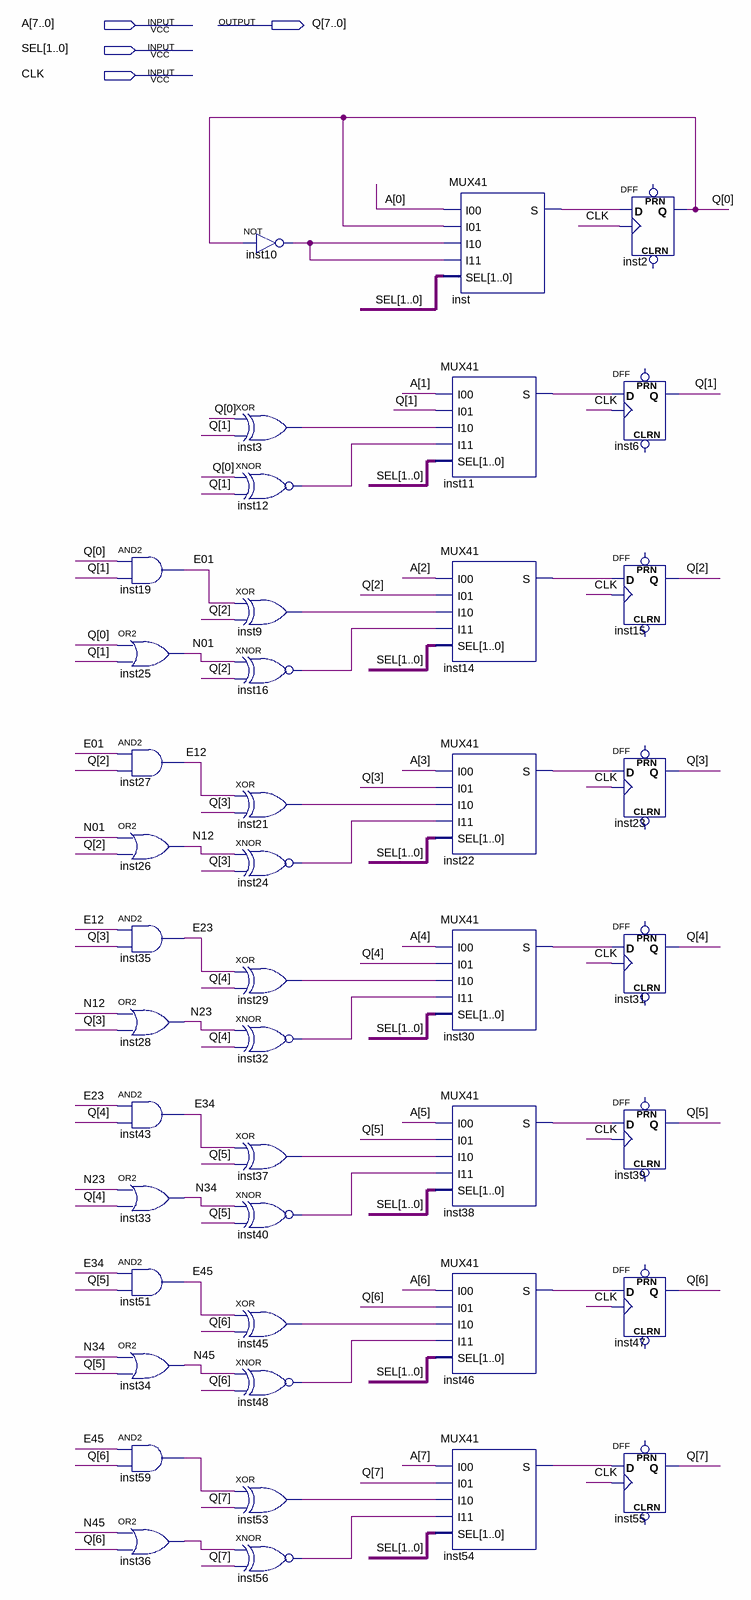
[diagram p0: schematic sheet]
// Quartus schematic CONTA_A_DOR.bdf as structural Verilog: 43 symbols, 4 pins
module CONTA_A_DOR (
  input  [7:0] A,
  input  [1:0] SEL,
  input  CLK,
  output [7:0] Q
);

  wire E01, E12, E23, E34, E45, inst3_out, inst9_out, inst10_out, inst11_s, inst12_out, inst14_s, inst16_out,
       inst21_out, inst22_s, inst24_out, inst29_out, inst30_s, inst32_out, inst36_out, inst37_out, inst38_s,
       inst40_out, inst45_out, inst46_s, inst48_out, inst53_out, inst54_s, inst56_out, inst59_out, inst_s,
       N01, N12, N23, N34, N45;

  and inst19 (E01, Q[0], Q[1]);
  or inst25 (N01, Q[0], Q[1]);
  and inst27 (E12, E01, Q[2]);
  or inst26 (N12, N01, Q[2]);
  and inst35 (E23, E12, Q[3]);
  or inst28 (N23, N12, Q[3]);
  and inst43 (E34, E23, Q[4]);
  or inst33 (N34, N23, Q[4]);
  and inst51 (E45, E34, Q[5]);
  or inst34 (N45, N34, Q[5]);
  and inst59 (inst59_out, E45, Q[6]);
  or inst36 (inst36_out, N45, Q[6]);
  not inst10 (inst10_out, Q[0]);
  xor inst3 (inst3_out, Q[0], Q[1]);
  xnor inst12 (inst12_out, Q[0], Q[1]);
  xor inst9 (inst9_out, E01, Q[2]);
  xnor inst16 (inst16_out, N01, Q[2]);
  xor inst21 (inst21_out, E12, Q[3]);
  xnor inst24 (inst24_out, N12, Q[3]);
  xor inst29 (inst29_out, E23, Q[4]);
  xnor inst32 (inst32_out, N23, Q[4]);
  xor inst37 (inst37_out, E34, Q[5]);
  xnor inst40 (inst40_out, N34, Q[5]);
  xor inst45 (inst45_out, E45, Q[6]);
  xnor inst48 (inst48_out, N45, Q[6]);
  xor inst53 (inst53_out, inst59_out, Q[7]);
  xnor inst56 (inst56_out, inst36_out, Q[7]);
  MUX41 inst (.I00(A[0]), .I01(Q[0]), .I10(inst10_out), .I11(inst10_out), .SEL(SEL), .S(inst_s));
  MUX41 inst11 (.I00(A[1]), .I01(Q[1]), .I10(inst3_out), .I11(inst12_out), .SEL(SEL), .S(inst11_s));
  MUX41 inst14 (.I00(A[2]), .I01(Q[2]), .I10(inst9_out), .I11(inst16_out), .SEL(SEL), .S(inst14_s));
  MUX41 inst22 (.I00(A[3]), .I01(Q[3]), .I10(inst21_out), .I11(inst24_out), .SEL(SEL), .S(inst22_s));
  MUX41 inst30 (.I00(A[4]), .I01(Q[4]), .I10(inst29_out), .I11(inst32_out), .SEL(SEL), .S(inst30_s));
  MUX41 inst38 (.I00(A[5]), .I01(Q[5]), .I10(inst37_out), .I11(inst40_out), .SEL(SEL), .S(inst38_s));
  MUX41 inst46 (.I00(A[6]), .I01(Q[6]), .I10(inst45_out), .I11(inst48_out), .SEL(SEL), .S(inst46_s));
  MUX41 inst54 (.I00(A[7]), .I01(Q[7]), .I10(inst53_out), .I11(inst56_out), .SEL(SEL), .S(inst54_s));
  DFF inst6 (.CLK(CLK), .D(inst11_s), .Q(Q[1]));  // open: CLRN, PRN
  DFF inst15 (.CLK(CLK), .D(inst14_s), .Q(Q[2]));  // open: CLRN, PRN
  DFF inst23 (.CLK(CLK), .D(inst22_s), .Q(Q[3]));  // open: CLRN, PRN
  DFF inst31 (.CLK(CLK), .D(inst30_s), .Q(Q[4]));  // open: CLRN, PRN
  DFF inst39 (.CLK(CLK), .D(inst38_s), .Q(Q[5]));  // open: CLRN, PRN
  DFF inst47 (.CLK(CLK), .D(inst46_s), .Q(Q[6]));  // open: CLRN, PRN
  DFF inst55 (.CLK(CLK), .D(inst54_s), .Q(Q[7]));  // open: CLRN, PRN
  DFF inst2 (.CLK(CLK), .D(inst_s), .Q(Q[0]));  // open: CLRN, PRN
endmodule
